# EAGLE design side (EAGLE 9.6.1)
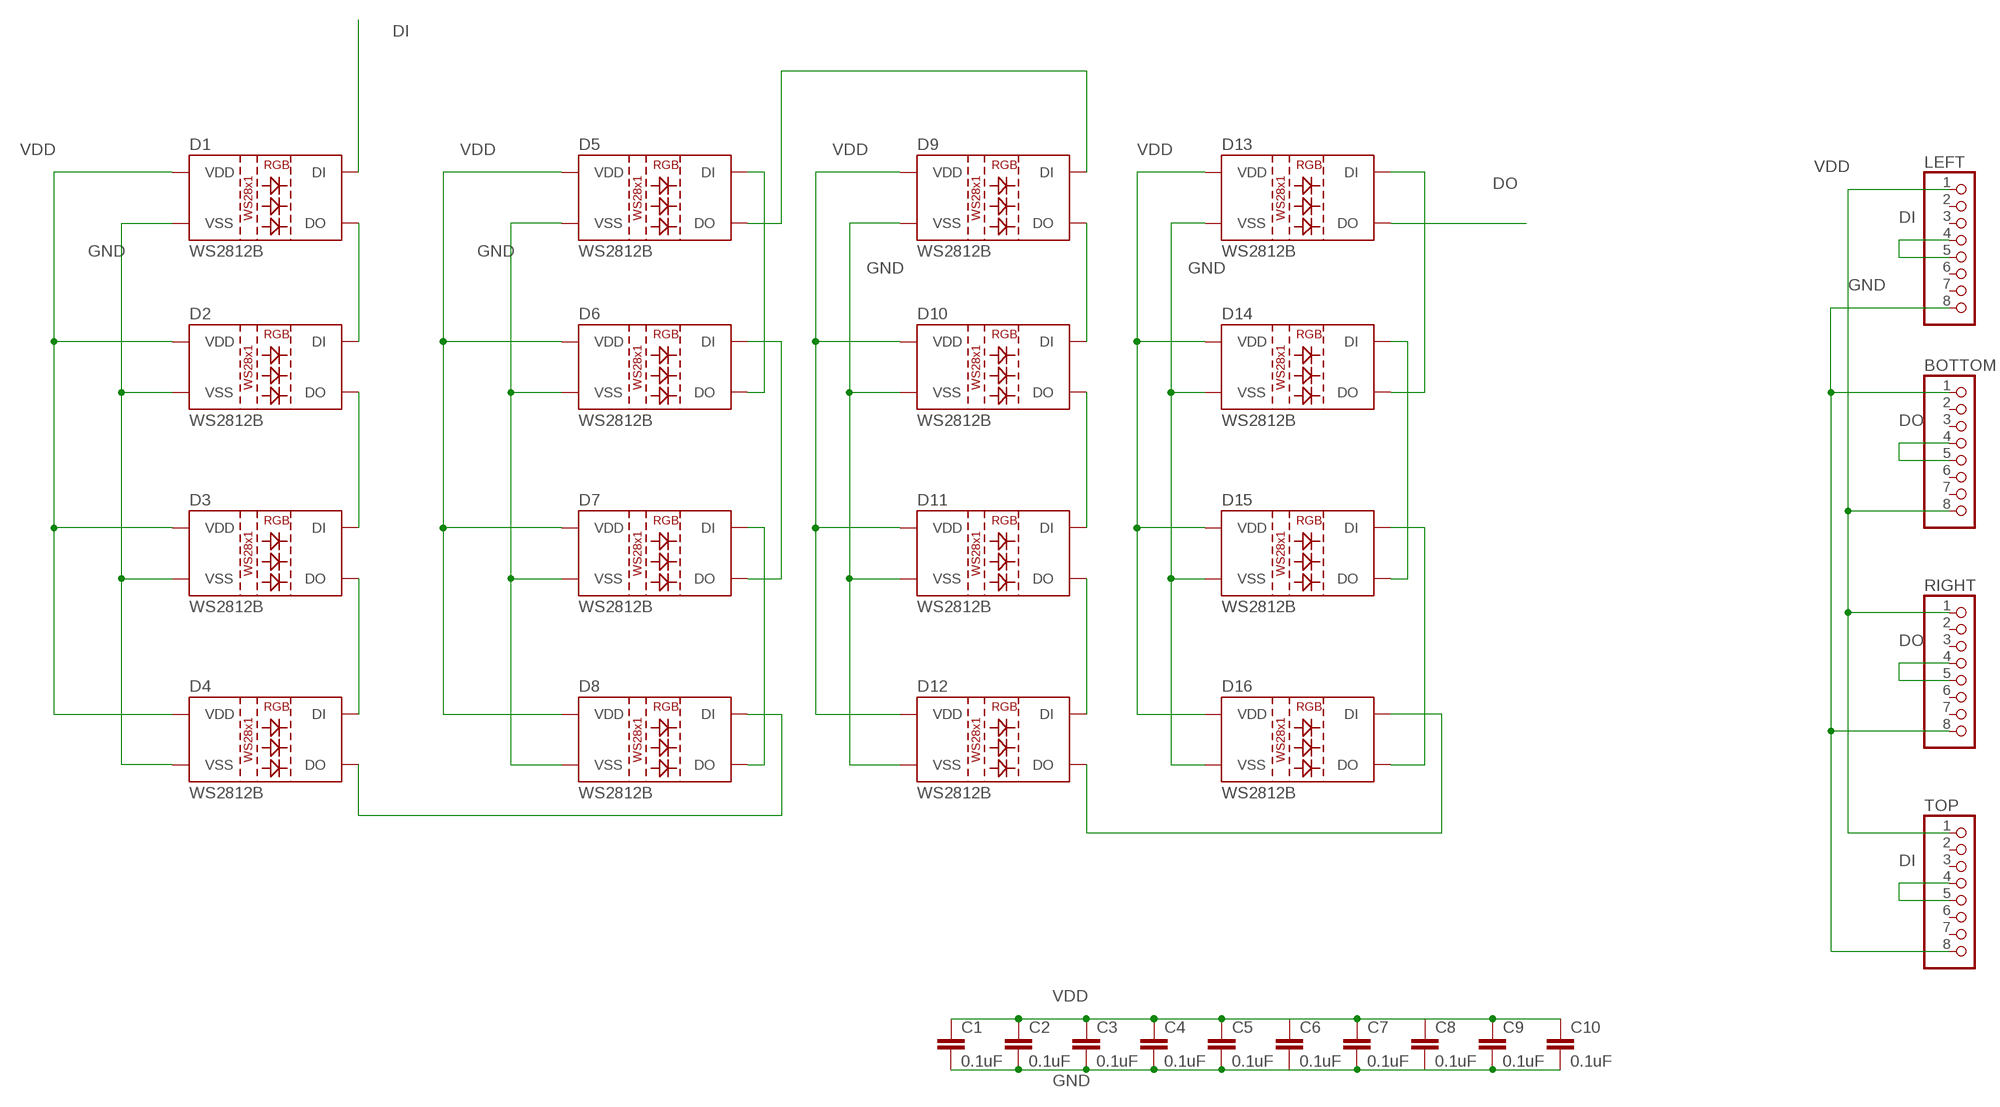
[diagram p0: schematic, sheet 1]

## Parts
BOTTOM  PINHD-1X8  [1X08]
C1  0.1uF  0.1UF-0603-25V-5%  [0603]
C2  0.1uF  0.1UF-0603-25V-5%  [0603]
C3  0.1uF  0.1UF-0603-25V-5%  [0603]
C4  0.1uF  0.1UF-0603-25V-5%  [0603]
C5  0.1uF  0.1UF-0603-25V-5%  [0603]
C6  0.1uF  0.1UF-0603-25V-5%  [0603]
C7  0.1uF  0.1UF-0603-25V-5%  [0603]
C8  0.1uF  0.1UF-0603-25V-5%  [0603]
C9  0.1uF  0.1UF-0603-25V-5%  [0603]
C10  0.1uF  0.1UF-0603-25V-5%  [0603]
D1  WS2812B  [WS2812B]
D2  WS2812B  [WS2812B]
D3  WS2812B  [WS2812B]
D4  WS2812B  [WS2812B]
D5  WS2812B  [WS2812B]
D6  WS2812B  [WS2812B]
D7  WS2812B  [WS2812B]
D8  WS2812B  [WS2812B]
D9  WS2812B  [WS2812B]
D10  WS2812B  [WS2812B]
D11  WS2812B  [WS2812B]
D12  WS2812B  [WS2812B]
D13  WS2812B  [WS2812B]
D14  WS2812B  [WS2812B]
D15  WS2812B  [WS2812B]
D16  WS2812B  [WS2812B]
LEFT  PINHD-1X8  [1X08]
RIGHT  PINHD-1X8  [1X08]
TOP  PINHD-1X8  [1X08]

## Nets
DI: D1.4(DI) LEFT.4 LEFT.5 TOP.4 TOP.5
DO: BOTTOM.4 BOTTOM.5 D13.2(DO) RIGHT.4 RIGHT.5
GND: BOTTOM.8 C1.2 C2.2 C3.2 C4.2 C5.2 C6.2 C7.2 C8.2 C9.2 C10.2 D1.3(VSS) D2.3(VSS) D3.3(VSS) D4.3(VSS) D5.3(VSS) D6.3(VSS) D7.3(VSS) D8.3(VSS) D9.3(VSS) D10.3(VSS) D11.3(VSS) D12.3(VSS) D13.3(VSS) D14.3(VSS) D15.3(VSS) D16.3(VSS) LEFT.1 RIGHT.1 TOP.1
N$1: D4.2(DO) D8.4(DI)
N$2: D7.4(DI) D8.2(DO)
N$3: D1.2(DO) D2.4(DI)
N$4: D2.2(DO) D3.4(DI)
N$5: D3.2(DO) D4.4(DI)
N$6: D6.4(DI) D7.2(DO)
N$7: D5.2(DO) D9.4(DI)
N$8: D12.2(DO) D16.4(DI)
N$9: D15.4(DI) D16.2(DO)
N$10: D9.2(DO) D10.4(DI)
N$11: D10.2(DO) D11.4(DI)
N$12: D11.2(DO) D12.4(DI)
N$13: D14.4(DI) D15.2(DO)
N$14: D13.4(DI) D14.2(DO)
N$16: D5.4(DI) D6.2(DO)
VDD [pow_width]: BOTTOM.1 C1.1 C2.1 C3.1 C4.1 C5.1 C6.1 C7.1 C8.1 C9.1 C10.1 D1.1(VDD) D2.1(VDD) D3.1(VDD) D4.1(VDD) D5.1(VDD) D6.1(VDD) D7.1(VDD) D8.1(VDD) D9.1(VDD) D10.1(VDD) D11.1(VDD) D12.1(VDD) D13.1(VDD) D14.1(VDD) D15.1(VDD) D16.1(VDD) LEFT.8 RIGHT.8 TOP.8
Unconnected: BOTTOM.2 BOTTOM.3 BOTTOM.6 BOTTOM.7 LEFT.2 LEFT.3 LEFT.6 LEFT.7 RIGHT.2 RIGHT.3 RIGHT.6 RIGHT.7 TOP.2 TOP.3 TOP.6 TOP.7

## Library data of the parts
BOTTOM LEFT RIGHT TOP = pinhead:PINHD-1X8: PIN HEADER
C1-C10 = SparkFun-Capacitors:0.1UF: 0.1µF ceramic capacitors A capacitor is a passive two-terminal electrical component used to store electrical energy temporarily in an electric field.; PROD_ID: CAP-08604
D1-D16 = my-LED-cube:WS2812B: WS2812B SMD addressable RGB LED 5x5mm SMD LED with built-in controller IC. Color: Red/Green/Blue mC Rating: RGB: 390, 660, 180 mcd Forward Voltage: RGB: 2.0, 3.0, 3.0 V Packages:WS2812B SparkFun Products: Blynk Board - ESP8266 <https://www.sparkfun.com/products/13794>; PROD_ID: DIO-12503

## Net classes
1 pow_width: width 0.102 mm

## Board
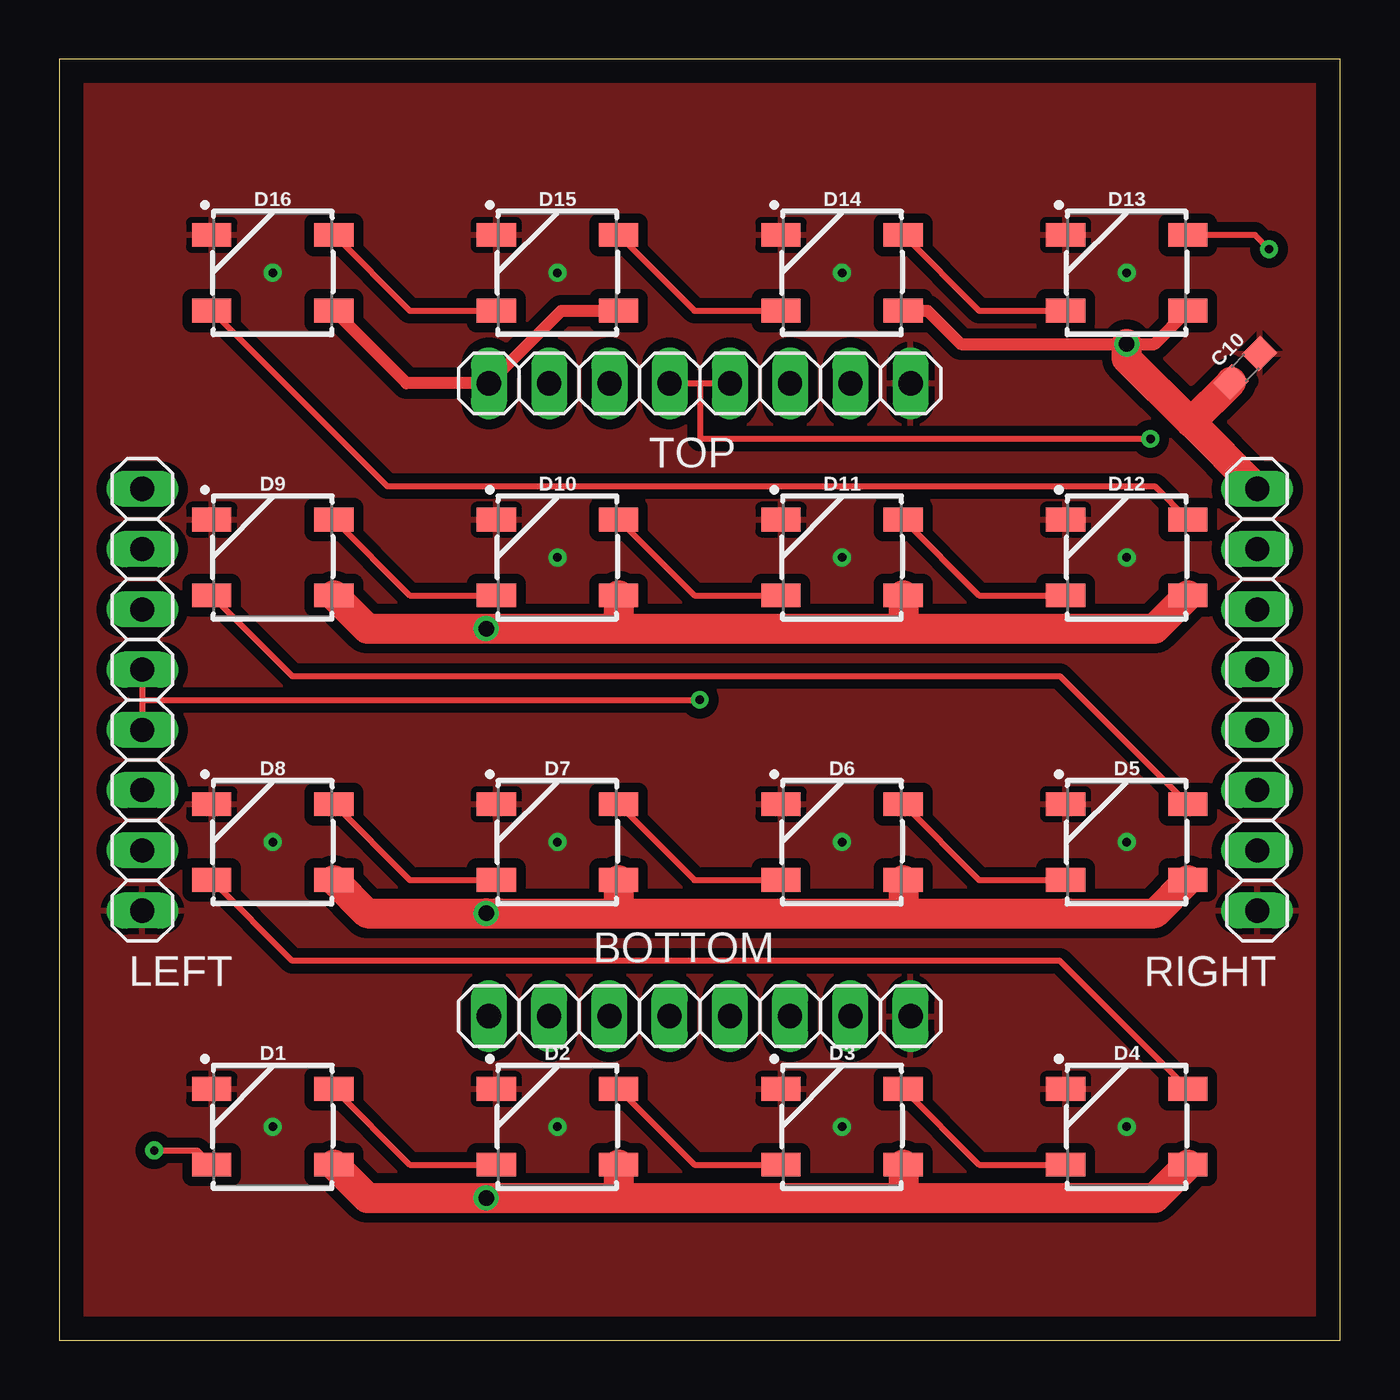
[diagram p1: board, top side]
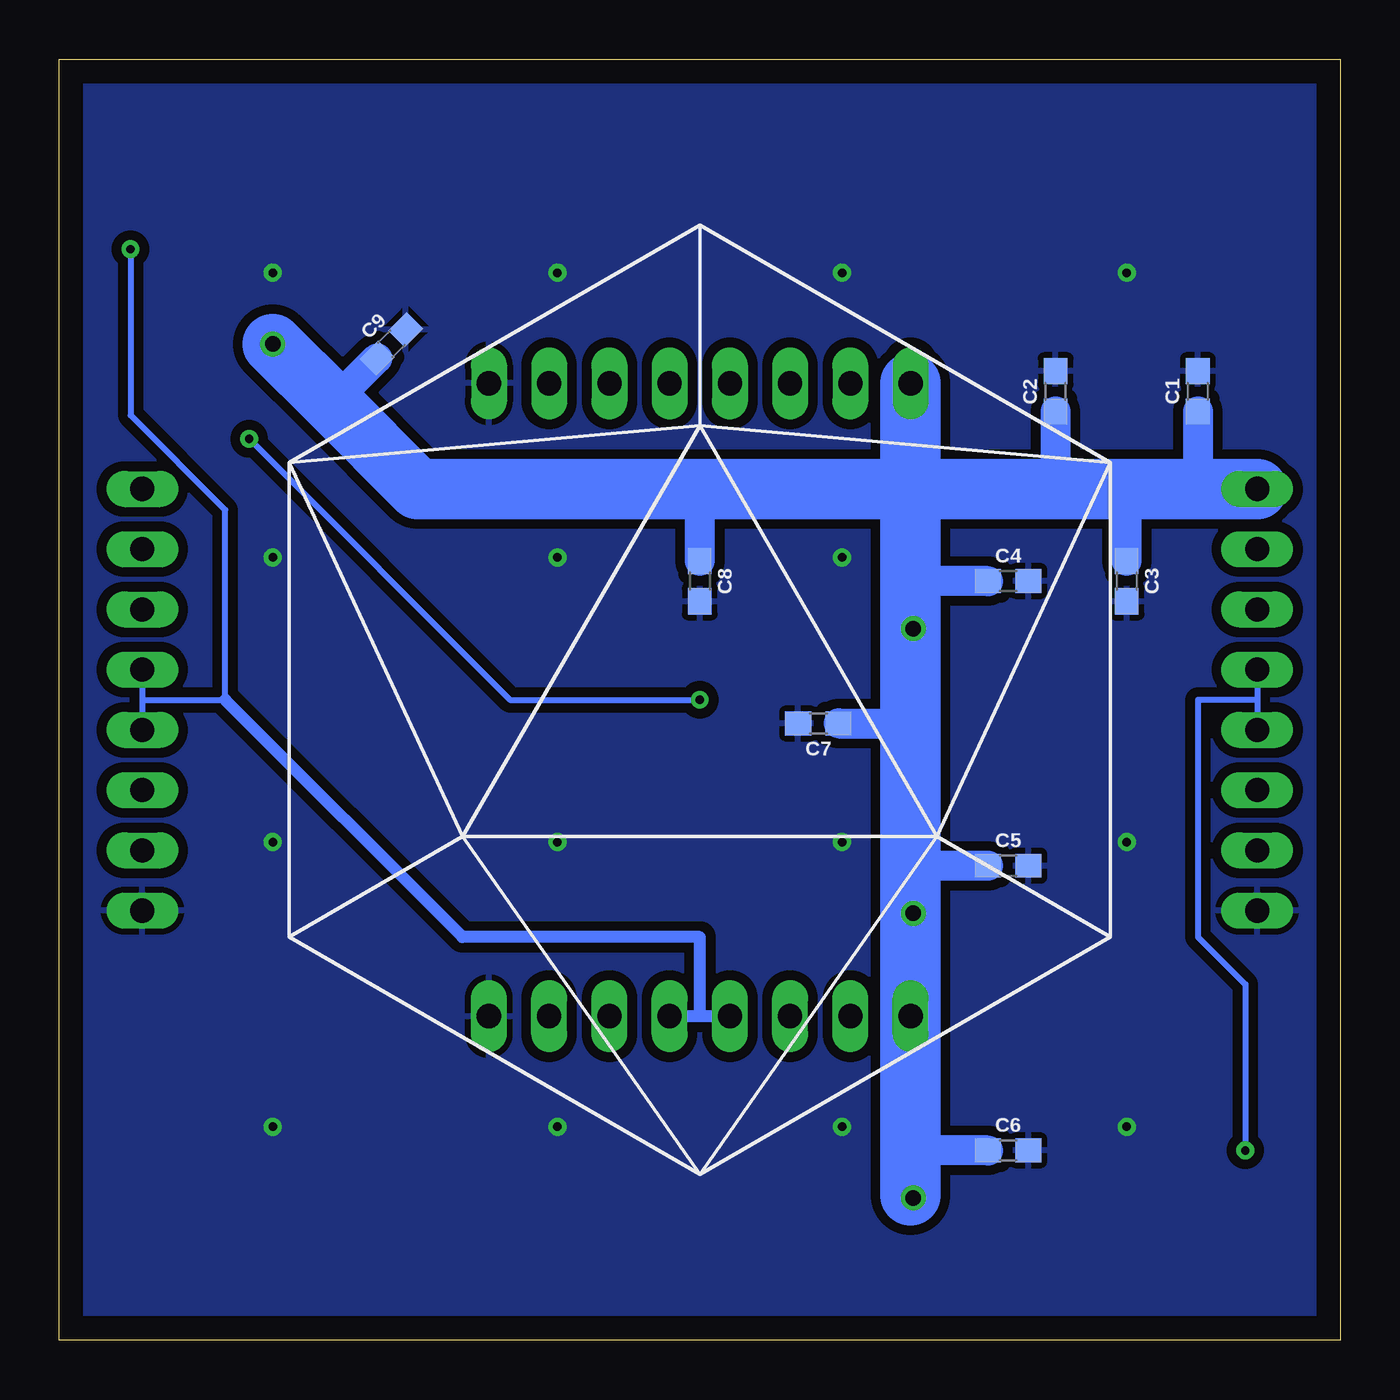
[diagram p2: board, bottom side, seen from below]

Size 54 x 54 mm. Coordinates in mm from the lower left corner, seen from the top.
Outline: 0,0 54,0 54,54 0,54 0,0
Copper layers (1*16): Top 0.035mm / dielectric 1.5mm / Bottom 0.035mm
Design rules "default *": minimum track width 6mil, minimum drill 0.35mm, track to track 6mil, track to pad 6mil, pad to pad 6mil, via to via 6mil, smd to smd 6mil, copper to edge 40mil, drill to drill 6mil, minimum pad ring 10mil, minimum via ring 8mil, stop-mask expansion 4mil, vias tented up to drill 100mil, thermal gap 10mil

### Footprints (pad centres in the part's own frame; a part is rotated, then mirrored left to right if it is on the bottom)
1X08 = drill 1.016 long: 1 -8.89,0; 2 -6.35,0; 3 -3.81,0; 4 -1.27,0; 5 1.27,0; 6 3.81,0; 7 6.35,0; 8 8.89,0
0603 = smd 1.1 x 1: 1 -0.85,0; 2 0.85,0
WS2812B = smd 1.651 x 1: 1 2.577,-1.6; 2 2.577,1.6; 3 -2.577,1.6; 4 -2.577,-1.6

### Placement (x,y rotation side)
BOTTOM  27,13.66 0 top
C1  6,40 90 bottom
C2  12,40 90 bottom
C3  9,32 270 bottom
C4  14,32 0 bottom
C5  14,20 0 bottom
C6  14,8 0 bottom
C7  22,26 180 bottom
C8  27,32 270 bottom
C9  40,42 45 bottom
C10  50,41 45 top
D1  9,9 0 top
D2  21,9 0 top
D3  33,9 0 top
D4  45,9 0 top
D5  45,21 0 top
D6  33,21 0 top
D7  21,21 0 top
D8  9,21 0 top
D9  9,33 0 top
D10  21,33 0 top
D11  33,33 0 top
D12  45,33 0 top
D13  45,45 0 top
D14  33,45 0 top
D15  21,45 0 top
D16  9,45 0 top
LEFT  3.5,27 90 top
RIGHT  50.5,27 90 top
TOP  27,40.34 180 top

### Tracks (layer width: path | path; a pad name or v marks a point on that pad's centre or on a via)
DI  (via drill 0.35)
  Top 0.254: v4,8 5.82,8 D1.4 | TOP.5 27,40.34 | 27,40.34 TOP.4 | LEFT.5 3.5,27 | 3.5,27 LEFT.4 | 3.5,27 v27,27 | 27,40.34 27,38 v46,38
  Bottom 0.254: LEFT.5 3.5,27 | 3.5,27 LEFT.4 | 3.5,27 6,27 6,17 4,15 v4,8 | v46,38 35,27 v27,27
DO  (via drill 0.35)
  Top 0.254: D13.2 50.4,46.6 v51,46
  Bottom 0.254: v51,46 51,39 47,35 47,27 50.5,27 | RIGHT.5 50.5,27 | 50.5,27 RIGHT.4
  Bottom 0.508: BOTTOM.4 27,13.66 | 27,13.66 BOTTOM.5 | 27,13.66 27,17 37,17 47,27
GND  (via drill 0.35)
  other vias: 45,9 33,9 21,9 9,9 9,21 21,21 33,21 45,21 45,33 33,33 21,33 45,45 33,45 21,45 9,45
  pour Top (isolate 0.406): 0,0 0,54 54,54 54,0
  pour Bottom (isolate 0.406): 0,0 0,54 54,54 54,0
N$1
  Top 0.254: D4.2 42.18,16 9.82,16 D8.4
N$2
  Top 0.254: D8.2 14.78,19.4 D7.4
N$3
  Top 0.254: D1.2 14.78,7.4 D2.4
N$4
  Top 0.254: D2.2 26.78,7.4 D3.4
N$5
  Top 0.254: D3.2 38.78,7.4 D4.4
N$6
  Top 0.254: D7.2 26.78,19.4 D6.4
N$7
  Top 0.254: D9.4 9.82,28 42.18,28 D5.2
N$8
  Top 0.254: D16.4 13.82,36 46.18,36 D12.2
N$9
  Top 0.254: D16.2 14.78,43.4 D15.4
N$10
  Top 0.254: D9.2 14.78,31.4 D10.4
N$11
  Top 0.254: D10.2 26.78,31.4 D11.4
N$12
  Top 0.254: D11.2 38.78,31.4 D12.4
N$13
  Top 0.254: D15.2 26.78,43.4 D14.4
N$14
  Top 0.254: D14.2 38.78,43.4 D13.4
N$16
  Top 0.254: D6.2 38.78,19.4 D5.4
VDD  (via drill 0.65)
  Top 0.508: D16.1 14.64,40.34 TOP.8 21.17,43.4 D15.1 | D14.1 36.6,43.4 38,42 v45,42 46.18,42 D13.1
  Top 1.27: D8.1 12.98,18 v18,18 23.58,18 | D5.1 46.18,18 35.58,18 | 23.58,18 35.58,18 | 23.58,6 v18,6 12.98,6 D1.1 | 23.58,6 35.58,6 | 35.58,6 46.18,6 D4.1 | D9.1 12.98,30 v18,30 23.58,30 | D12.1 46.18,30 35.58,30 | 23.58,30 35.58,30 | D2.1 23.58,6 | D3.1 35.58,6 | D7.1 23.58,18 | D6.1 35.58,18 | D10.1 23.58,30 | D11.1 35.58,30 | RIGHT.8 47.7,38.7 | 47.7,38.7 45,41.39 v45,42 | C10.1 47.7,38.7
  Bottom 0.152: v18,6 18.11,6.11
  Bottom 0.254: BOTTOM.1 18,13.77 v18,18 18,20 18,26 v18,30 | v18,6 18,8
  Bottom 1.27: C1.1 6,35.89 | C2.1 12,35.89 | C3.1 9,35.89 | C4.1 18.11,32 | C5.1 18,20 | C6.1 18,8 | C7.1 18,26 | C8.1 27,35.89 | C9.1 42.5,39.5
  Bottom 2.54: LEFT.8 6,35.89 9,35.89 12,35.89 18,35.89 | 18,35.89 27,35.89 38.89,35.89 42.5,39.5 v45,42 | TOP.8 18.11,36 | 18.11,36 18,35.89 | 18.11,36 18.11,32 BOTTOM.1 18.11,6.11